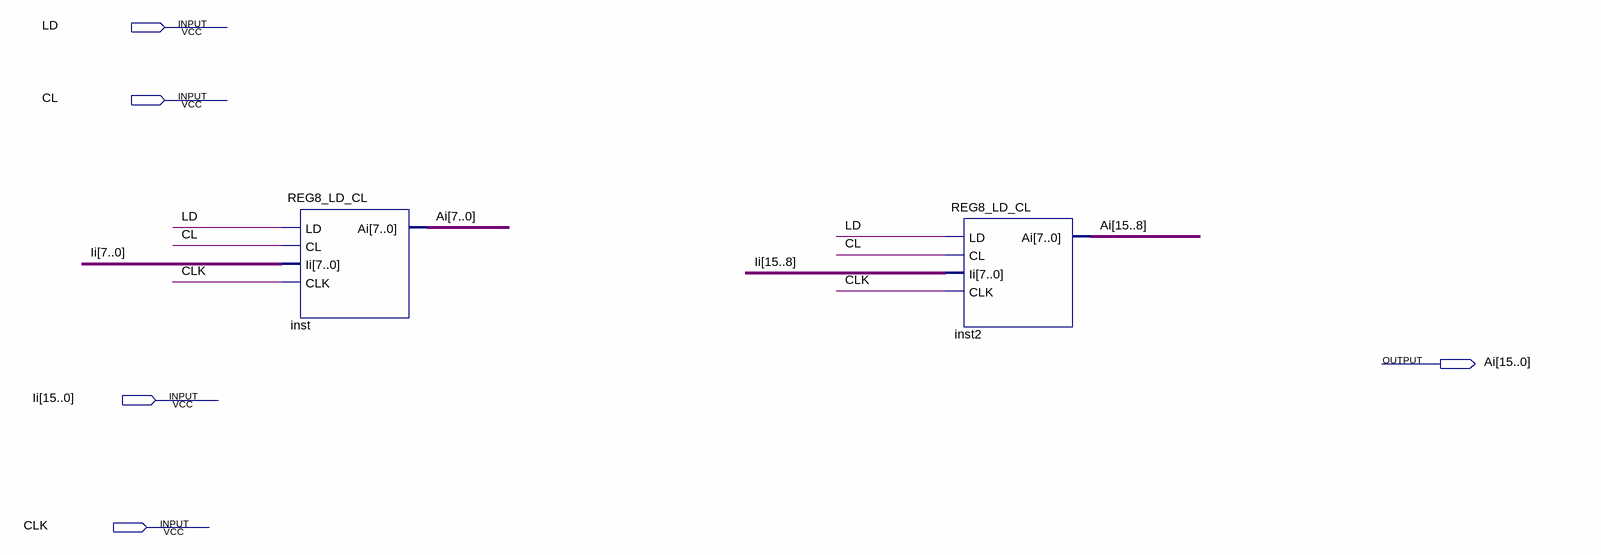
[diagram p0: schematic sheet]
// Quartus schematic REG16_LD_CL.bdf as structural Verilog: 2 symbols, 5 pins
module REG16_LD_CL (
  input  LD,
  input  CL,
  input  [15:0] Ii,
  input  CLK,
  output [15:0] Ai
);

  REG8_LD_CL inst (.LD(LD), .CL(CL), .Ii(Ii[7:0]), .CLK(CLK), .Ai(Ai[7:0]));
  REG8_LD_CL inst2 (.LD(LD), .CL(CL), .Ii(Ii[15:8]), .CLK(CLK), .Ai(Ai[15:8]));
endmodule
